# EAGLE design IntelliRoastSch (EAGLE 9.3.1)

## Sheet 1 of 4: STM32 Zio Headers
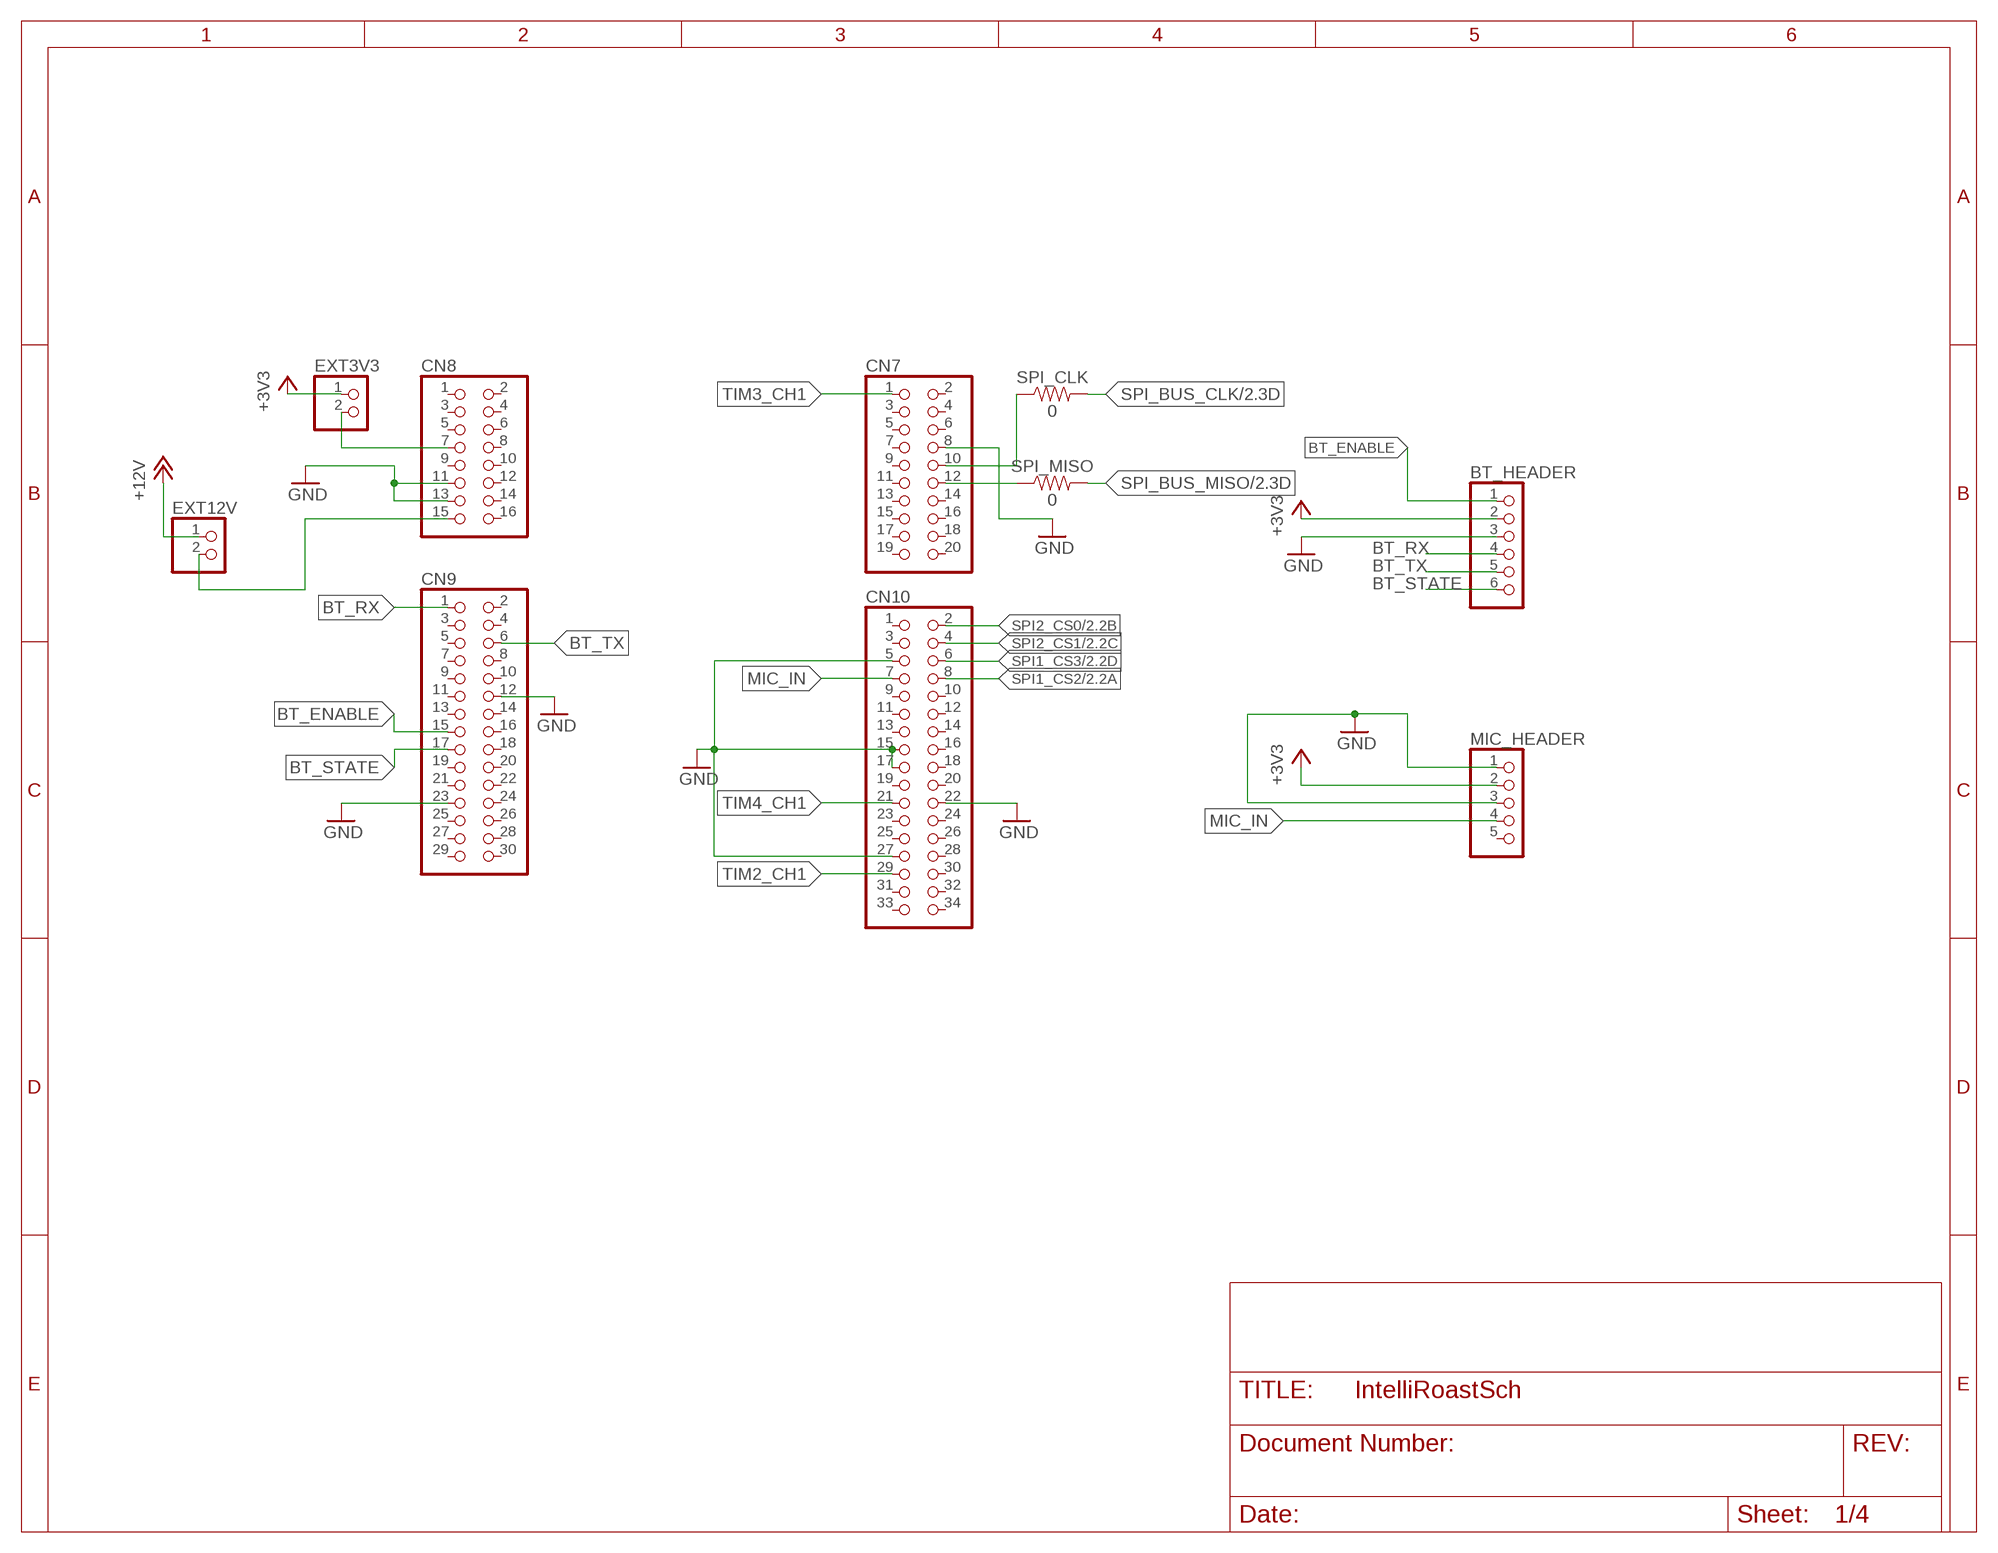
[diagram p0: schematic, sheet 1]

### Parts
BT_HEADER  HC-05-BREAKOUT  [HC-O5_HEADER]
CN7  PINHD-2X10  [2X10]
CN8  PINHD-2X8  [2X08]
CN9  PINHD-2X15  [2X15]
CN10  PINHD-2X17  [2X17]
EXT3V3  PINHD-1X2  [1X02]
EXT12V  PINHD-1X2  [1X02]
MIC_HEADER  PINHD-1X5  [1X05]
SPI_CLK  0  0OHM-0603-1/10W-5%  [0603]
SPI_MISO  0  0OHM-0603-1/10W-5%  [0603]

### Nets
+3V3: BT_HEADER.2 EXT3V3.1 MIC_HEADER.2 ; also sheet 2,3
+12V: EXT12V.1 ; also sheet 3,4
BT_ENABLE: BT_HEADER.1 CN9.15
BT_RX: BT_HEADER.4 CN9.1
BT_STATE: BT_HEADER.6 CN9.17
BT_TX: BT_HEADER.5 CN9.6
GND: BT_HEADER.3 CN7.8 CN8.11 CN8.13 CN9.12 CN9.23 CN10.5 CN10.15 CN10.17 CN10.22 CN10.27 MIC_HEADER.1 MIC_HEADER.3 ; also sheet 2,3,4
MIC_IN: CN10.7 MIC_HEADER.4
N$2: CN8.7 EXT3V3.2
N$3: CN8.15 EXT12V.2
SPI1_CS2: CN10.8 ; also sheet 2
SPI1_CS3: CN10.6 ; also sheet 2
SPI1_MISO: CN7.12 SPI_MISO.1
SPI1_SCK: CN7.10 SPI_CLK.1
SPI2_CS0: CN10.2 ; also sheet 2
SPI2_CS1: CN10.4 ; also sheet 2
SPI_BUS_CLK: SPI_CLK.2 ; also sheet 2
SPI_BUS_MISO: SPI_MISO.2 ; also sheet 2
TIM2_CH1: CN10.29
TIM3_CH1: CN7.1 ; also sheet 4
TIM4_CH1: CN10.21
Unconnected: CN7.2 CN7.3 CN7.4 CN7.5 CN7.6 CN7.7 CN7.9 CN7.11 CN7.13 CN7.14 CN7.15 CN7.16 CN7.17 CN7.18 CN7.19 CN7.20 CN8.1 CN8.2 CN8.3 CN8.4 CN8.5 CN8.6 CN8.8 CN8.9 CN8.10 CN8.12 CN8.14 CN8.16 CN9.2 CN9.3 CN9.4 CN9.5 CN9.7 CN9.8 CN9.9 CN9.10 CN9.11 CN9.13 CN9.14 CN9.16 CN9.18 CN9.19 CN9.20 CN9.21 CN9.22 CN9.24 CN9.25 CN9.26 CN9.27 CN9.28 CN9.29 CN9.30 CN10.1 CN10.3 CN10.9 CN10.10 CN10.11 CN10.12 CN10.13 CN10.14 CN10.16 CN10.18 CN10.19 CN10.20 CN10.23 CN10.24 CN10.25 CN10.26 CN10.28 CN10.30 CN10.31 CN10.32 CN10.33 CN10.34 MIC_HEADER.5

## Sheet 2 of 4: MAX31855 Thermocouple Amplifiers
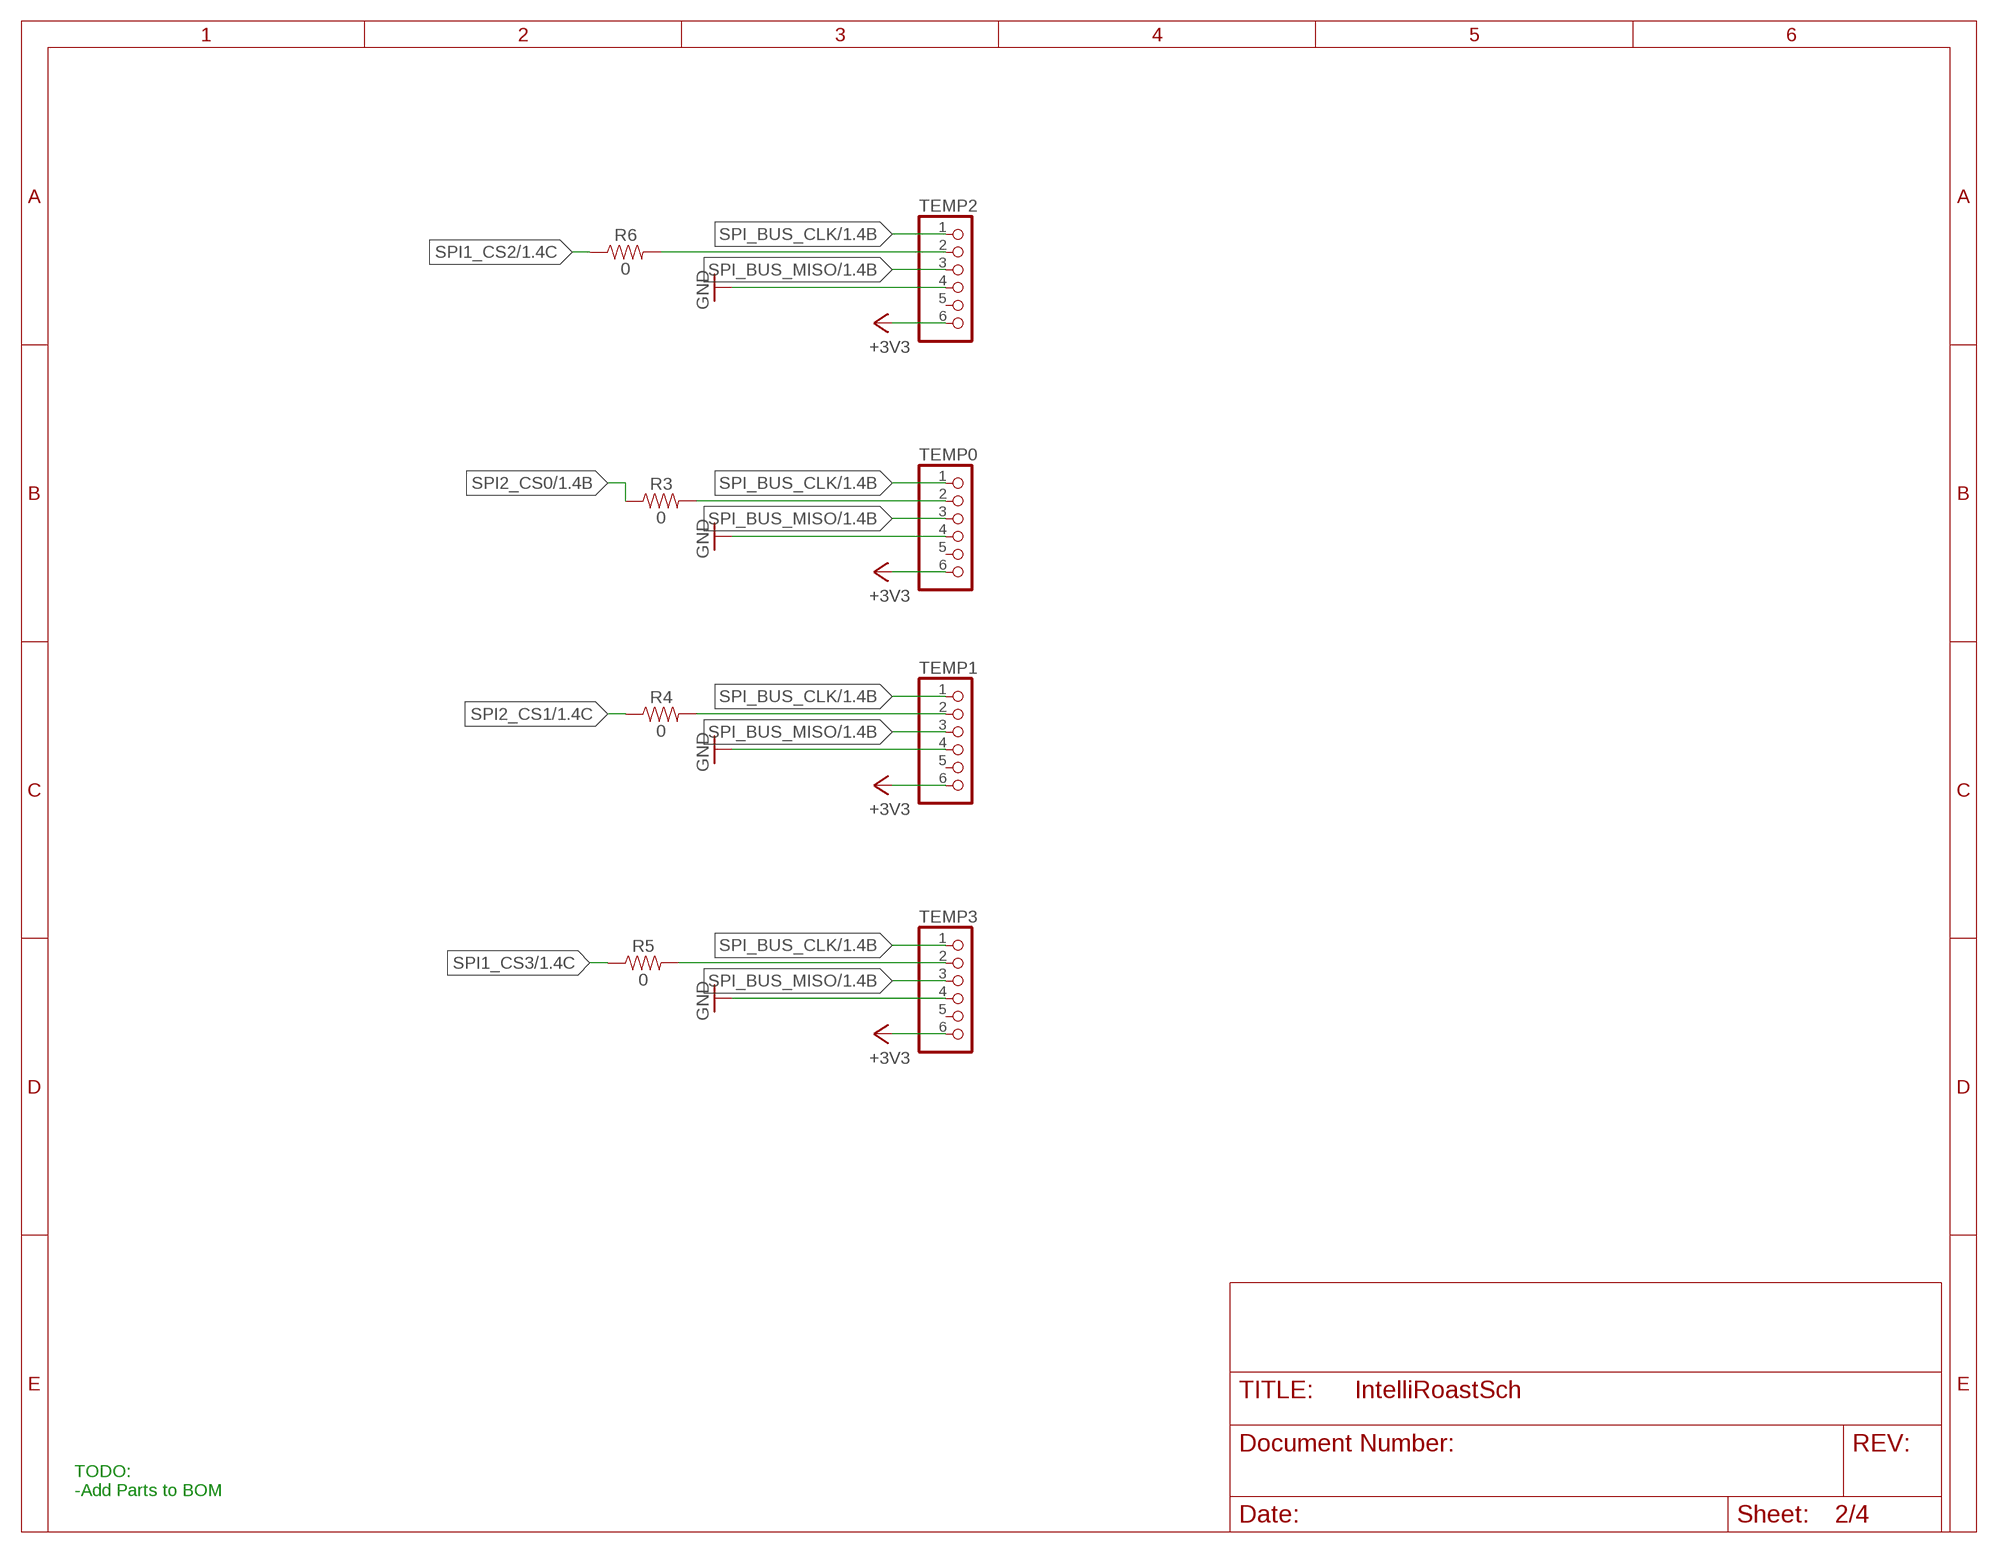
[diagram p1: schematic, sheet 2]

### Parts
R3  0  0OHM-0603-1/10W-5%  [0603]
R4  0  0OHM-0603-1/10W-5%  [0603]
R5  0  0OHM-0603-1/10W-5%  [0603]
R6  0  0OHM-0603-1/10W-5%  [0603]
TEMP0  ADAFRUIT-MAX31855-BREAKOUT  [MAX31855_HEADER]
TEMP1  ADAFRUIT-MAX31855-BREAKOUT  [MAX31855_HEADER]
TEMP2  ADAFRUIT-MAX31855-BREAKOUT  [MAX31855_HEADER]
TEMP3  ADAFRUIT-MAX31855-BREAKOUT  [MAX31855_HEADER]

### Nets
+3V3: TEMP0.6 TEMP1.6 TEMP2.6 TEMP3.6 ; also sheet 1,3
GND: TEMP0.4 TEMP1.4 TEMP2.4 TEMP3.4 ; also sheet 1,3,4
SPI1_CS2: R6.1 ; also sheet 1
SPI1_CS2_RES: R6.2 TEMP2.2
SPI1_CS3: R5.1 ; also sheet 1
SPI1_CS3_RES: R5.2 TEMP3.2
SPI2_CS0: R3.1 ; also sheet 1
SPI2_CS0_RES: R3.2 TEMP0.2
SPI2_CS1: R4.1 ; also sheet 1
SPI2_CS1_RES: R4.2 TEMP1.2
SPI_BUS_CLK: TEMP0.1 TEMP1.1 TEMP2.1 TEMP3.1 ; also sheet 1
SPI_BUS_MISO: TEMP0.3 TEMP1.3 TEMP2.3 TEMP3.3 ; also sheet 1
Unconnected: TEMP0.5 TEMP1.5 TEMP2.5 TEMP3.5

### Notes on the sheet
- TODO:
  -Add Parts to BOM

## Sheet 3 of 4: 3V3 Power Regulator
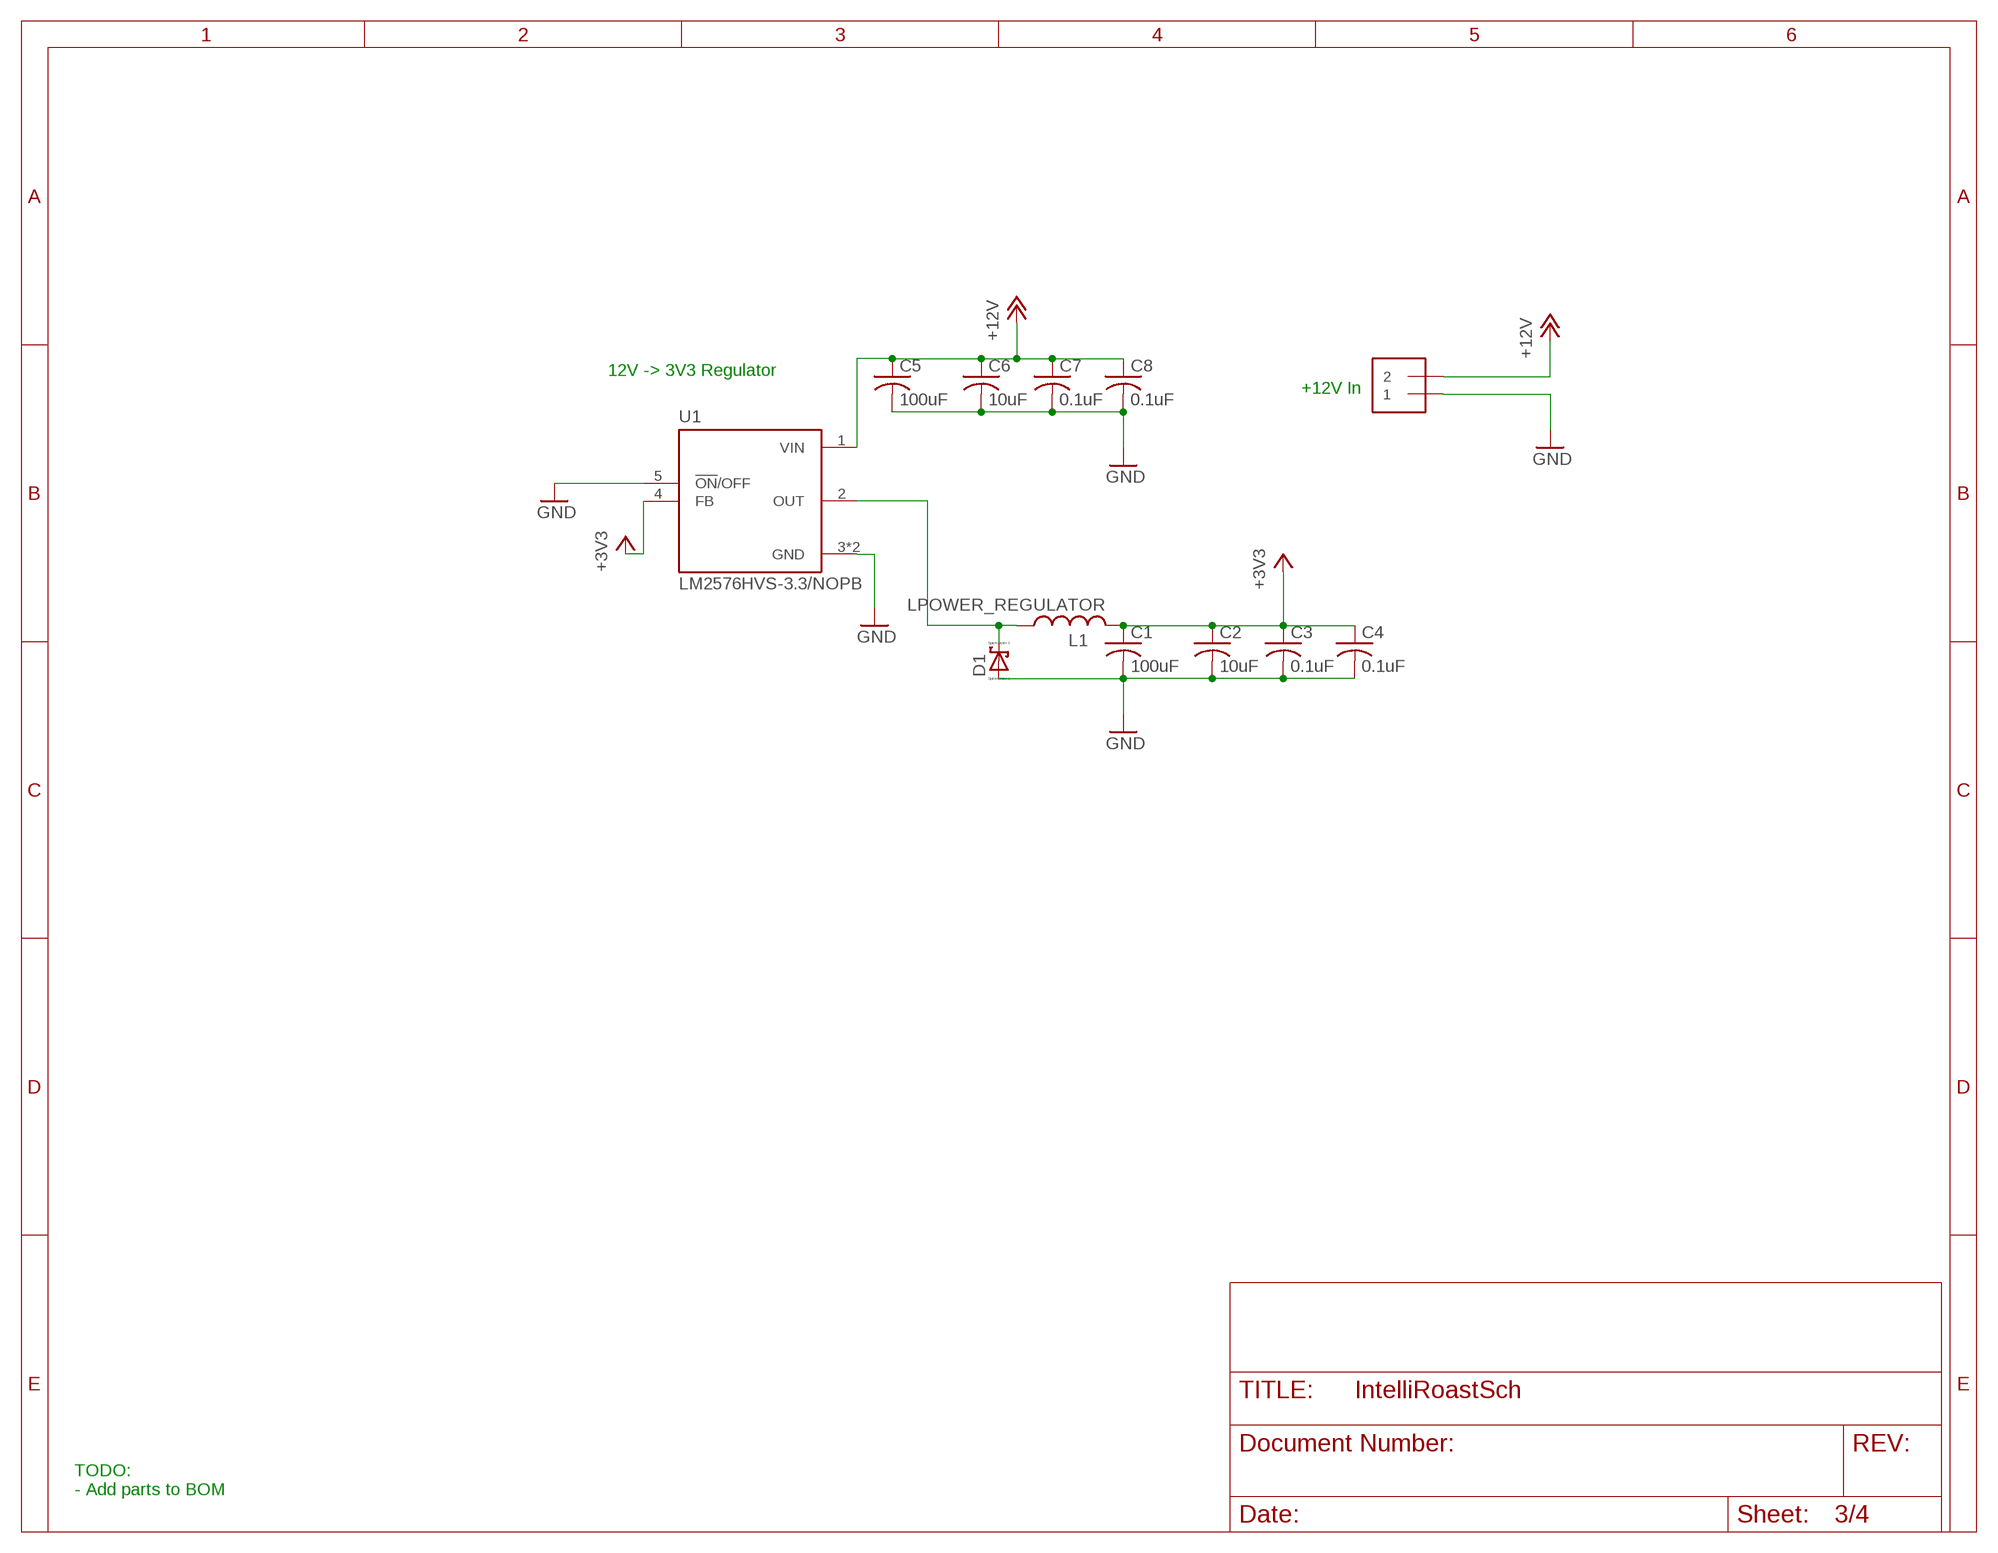
[diagram p2: schematic, sheet 3]

### Parts
C1  100uF  C-USC1210  [C1210]
C2  10uF  C-USC0805  [C0805]
C3  0.1uF  C-USC0603  [C0603]
C4  0.1uF  C-USC0603  [C0603]
C5  100uF  C-USC1210  [C1210]
C6  10uF  C-USC0805  [C0805]
C7  0.1uF  C-USC0603  [C0603]
C8  0.1uF  C-USC0603  [C0603]
D1  SCHOTTKY-DIODESMC  [DIODE_SMC]
L1  LPOWER_REGULATOR  [L74477020]
PWR_IN  1X2-3.5MM  [1X2-3.5MM]
U1  LM2576HVS-3.3/NOPB  [TO170P1435X465-6N]

### Nets
+3V3: C1.1 C2.1 C3.1 C4.1 L1.2 U1.4(FB) ; also sheet 1,2
+12V: C5.1 C6.1 C7.1 C8.1 PWR_IN.2 U1.1(VIN) ; also sheet 1,4
GND: C1.2 C2.2 C3.2 C4.2 C5.2 C6.2 C7.2 C8.2 D1.A(C) PWR_IN.1 U1.3(GND) U1.5(!ON!/OFF) U1.6(GND) ; also sheet 1,2,4
OUT: D1.C(A) L1.1 U1.2(OUT)

### Notes on the sheet
- 12V -> 3V3 Regulator
- +12V In
- TODO:
  - Add parts to BOM

## Sheet 4 of 4: Fan Controller
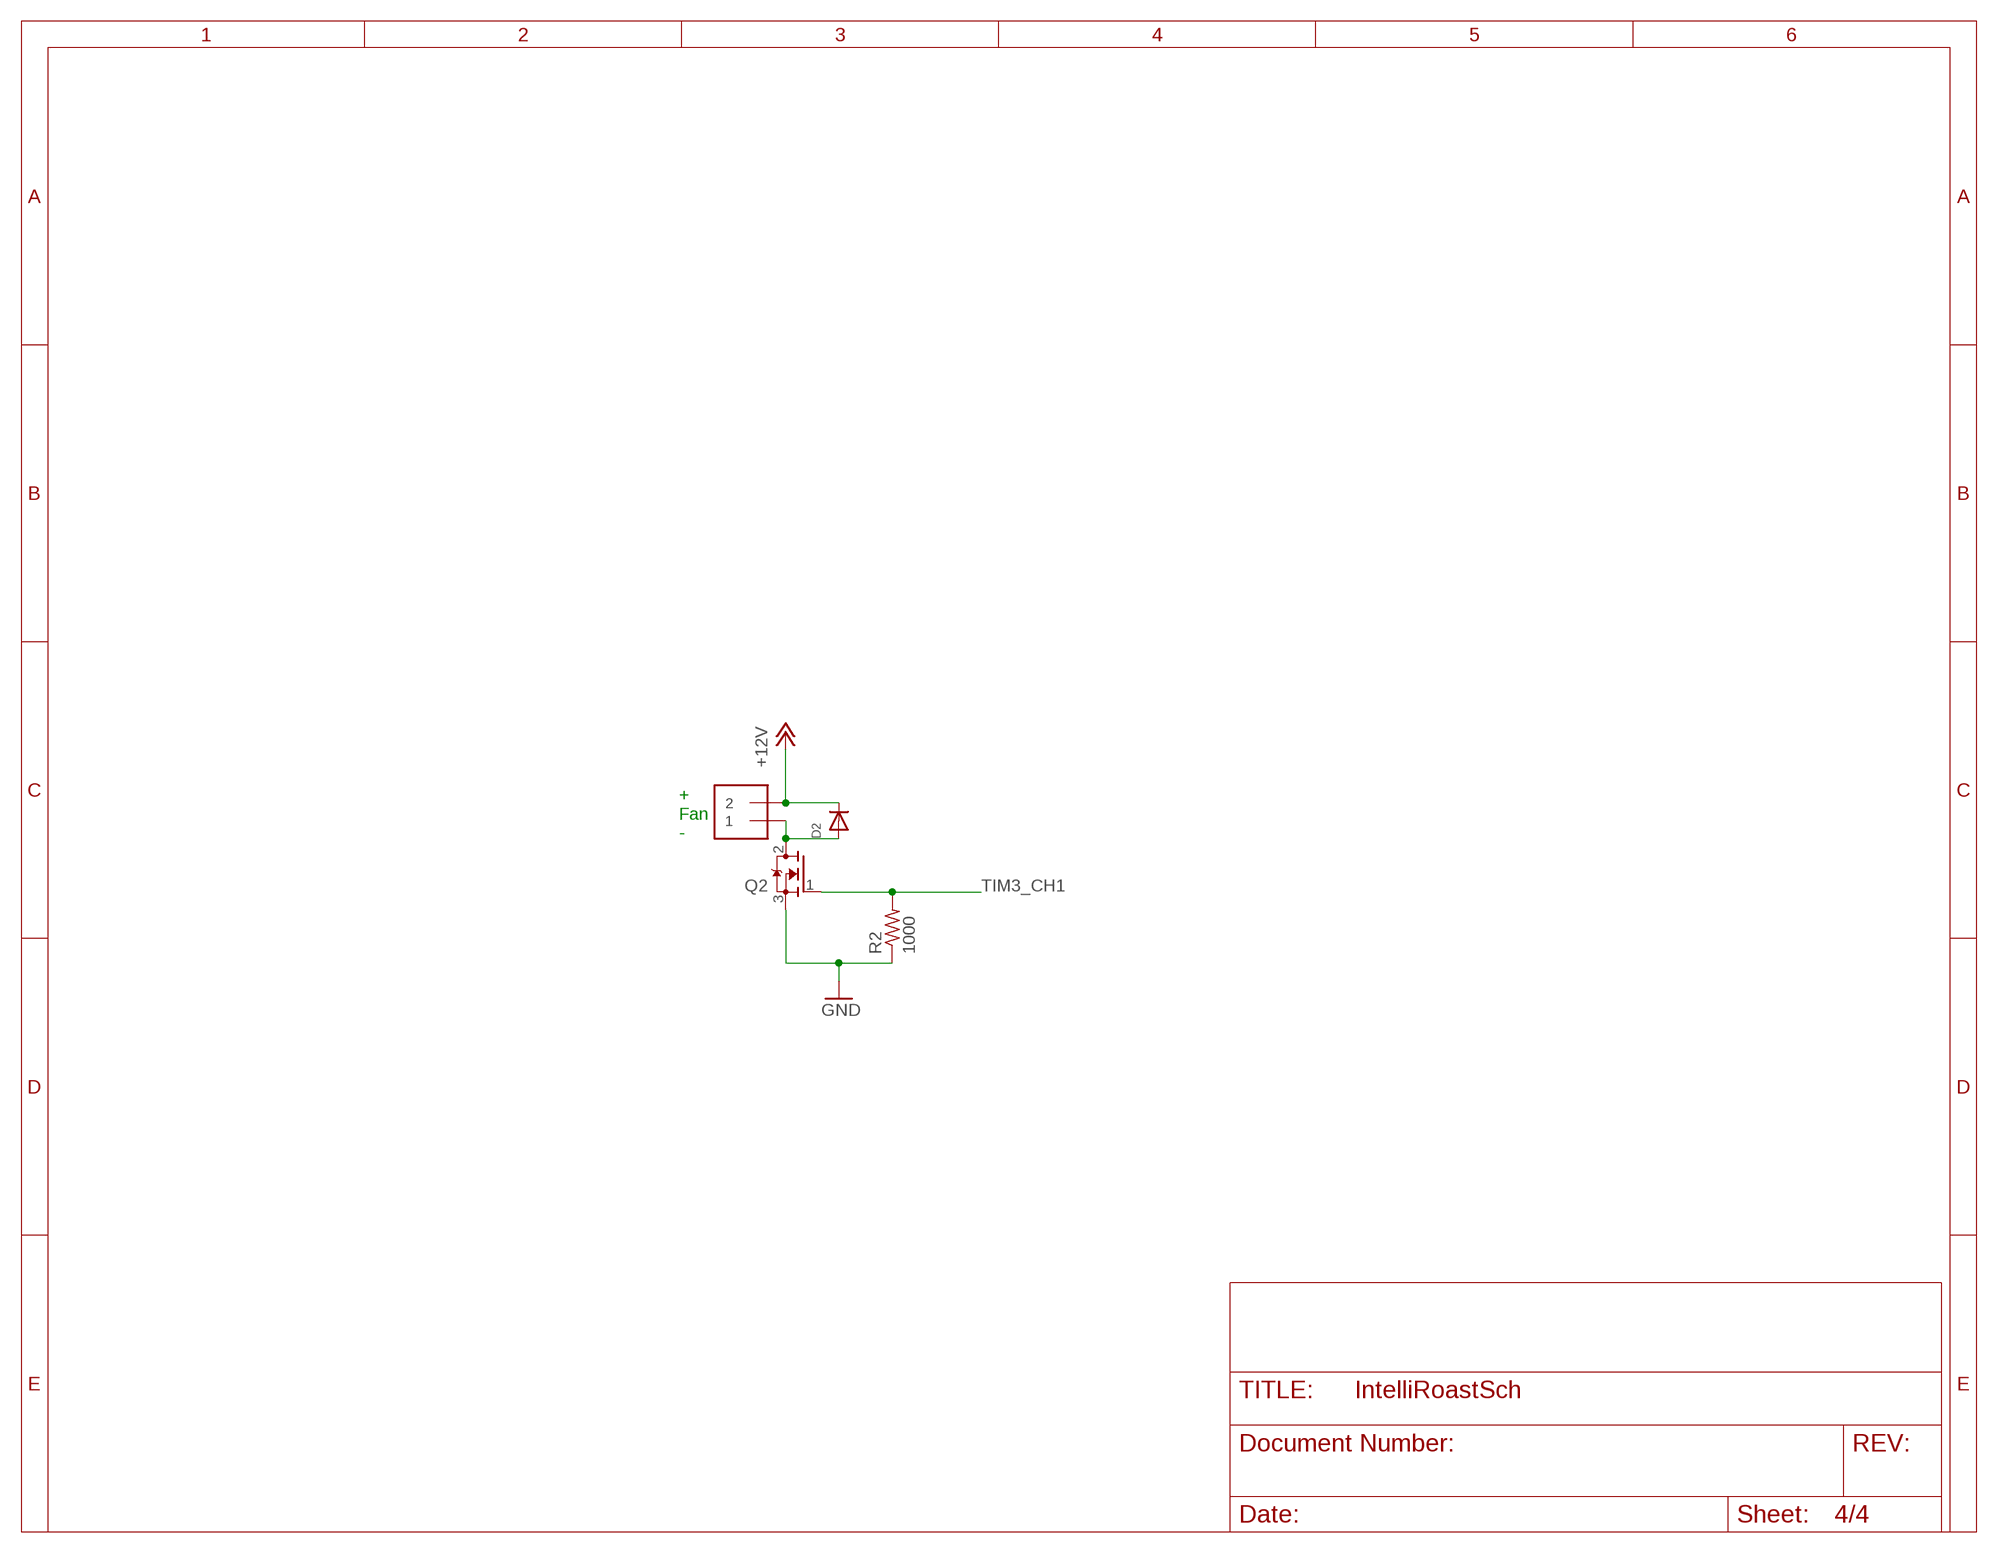
[diagram p3: schematic, sheet 4]

### Parts
D2  DIODESMA  [SMADIODE]
FAN  1X2-3.5MM  [1X2-3.5MM]
Q2  MOSFET-NGDS_TO220V  [TO220V]
R2  1000  R-US_R0603  [R0603]

### Nets
+12V: D2.C FAN.2 ; also sheet 1,3
FAN_TO_MOS: D2.A FAN.1 Q2.2(D)
GND: Q2.3(S) R2.1 ; also sheet 1,2,3
TIM3_CH1: Q2.1(G) R2.2 ; also sheet 1

### Notes on the sheet
- +
  Fan
  -

## Library data of the parts
BT_HEADER = IntelliRoast:HC-05-BREAKOUT: PIN HEADER
C1-C8 = adafruit:C-US: CAPACITOR, American symbol
CN7 = pinhead:PINHD-2X10: PIN HEADER
CN8 = pinhead:PINHD-2X8: PIN HEADER
CN9 = pinhead:PINHD-2X15: PIN HEADER
CN10 = pinhead:PINHD-2X17: PIN HEADER
D1 = eagle-ltspice:SCHOTTKY-DIODE: Schottky Diode; SPICEMODEL: NONE; SPICEPREFIX: D; SPICETYPE: diode
D2 = adafruit:DIODE: Diode SMADIODE - SMA Surface Mount Package 20V 1A Schottky Diode Digikey: 641-1014-6-ND DO-1N4148 - Through Hole Small Current Diode SOD-123 20V 1 A (.5mV Vf) Schottky Diode - Digikey: MBRX120TPMSCT-ND SOD-323 10V 570mA (.38mV Vf, 3ns) Schottky Diode - Digikey: ZLLS410CT-ND SOD-523 30V 30mA Schottky Diode (RB751S-40TE61) - Digikey: RB751S-40TE61CT-ND SOT23-R/W - SOT23 Package (R = Solder Paste/Reflow Ovens, W = Hand-Soldering) BAT54Film 40V 300mA - Digikey: 497-7162-1-ND
EXT3V3 EXT12V = pinhead:PINHD-1X2: PIN HEADER
FAN PWR_IN = adafruit:1X2: 3.5mm Terminal block http://www.ladyada.net/library/pcb/eaglelibrary.html
L1 = IntelliRoast:L
MIC_HEADER = pinhead:PINHD-1X5: PIN HEADER
Q2 = adafruit:MOSFET-N: N-Channel Mosfet 2N7002E - 60V 260mA SOT23 [Digikey: 2N7002ET1GOSTR-ND] - REEL BSH103 - 30V 850mA SOT23 [Digikey: 568-5013-1-ND]
R2 = rcl:R-US_: RESISTOR, American symbol; SPICEPREFIX: R
R3-R6 SPI_CLK SPI_MISO = SparkFun-Resistors:0OHM: 0Ω resistor A resistor is a passive two-terminal electrical component that implements electrical resistance as a circuit element. Resistors act to reduce current flow, and, at the same time, act to lower voltage levels within circuits. - Wikipedia; PROD_ID: RES-08609
TEMP0 TEMP1-TEMP3 = IntelliRoast:ADAFRUIT-MAX31855-BREAKOUT: PIN HEADER
U1 = LM2576HVS-3.3_NOPB:LM2576HVS-3.3/NOPB: SIMPLE SWITCHER? 4V to 60V, 3A Low Component Count Step-Down Regulator 5-DDPAK/TO-263 -40 to 125; AVAILABILITY: Unavailable; DESCRIPTION: SIMPLE SWITCHER? 4V to 60V, 3A Low Component Count Step-Down Regulator 5-DDPAK/TO-263 -40 to 125; MF: Texas Instruments; MP: LM2576HVS-3.3/NOPB; PACKAGE: TO-263-5 Texas Instruments; PRICE: None

## Board
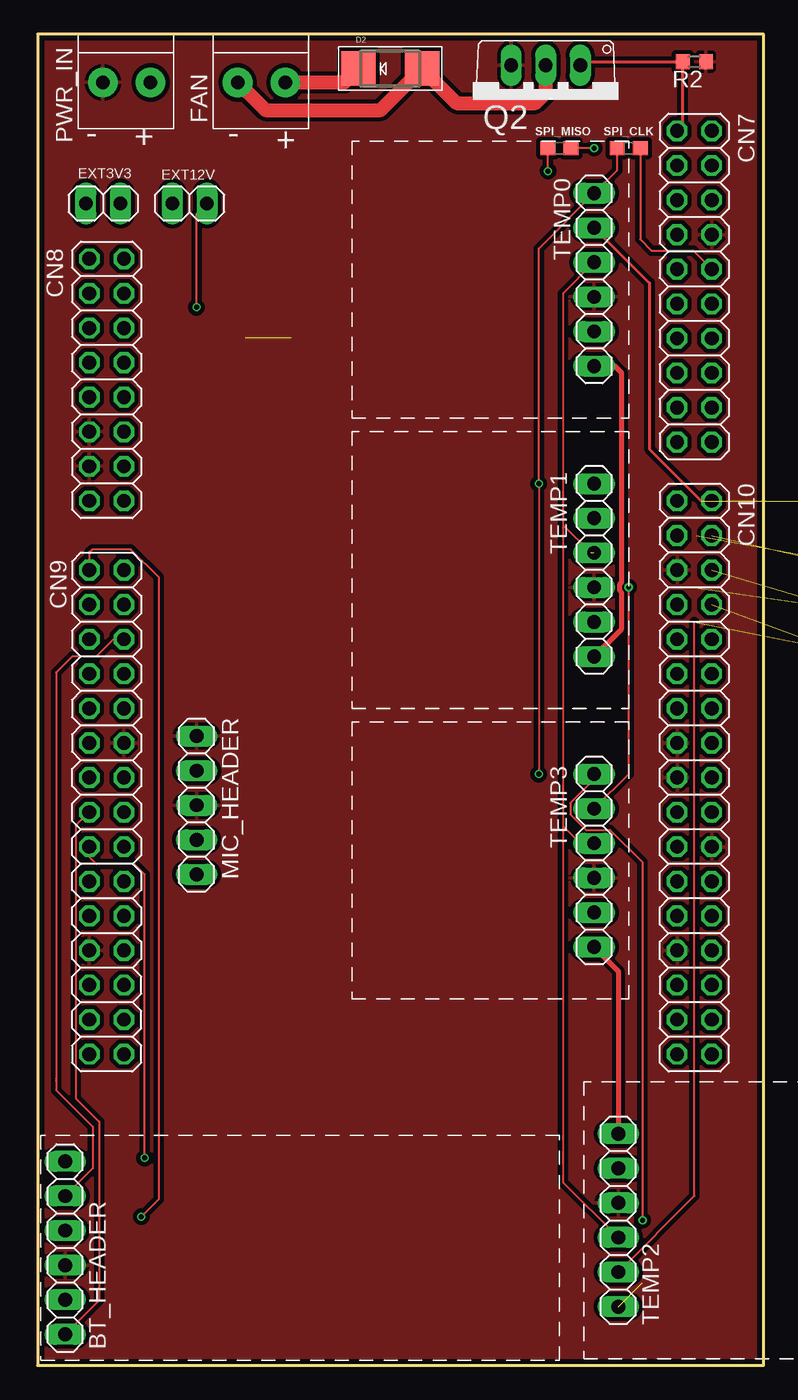
[diagram p4: board, top side]
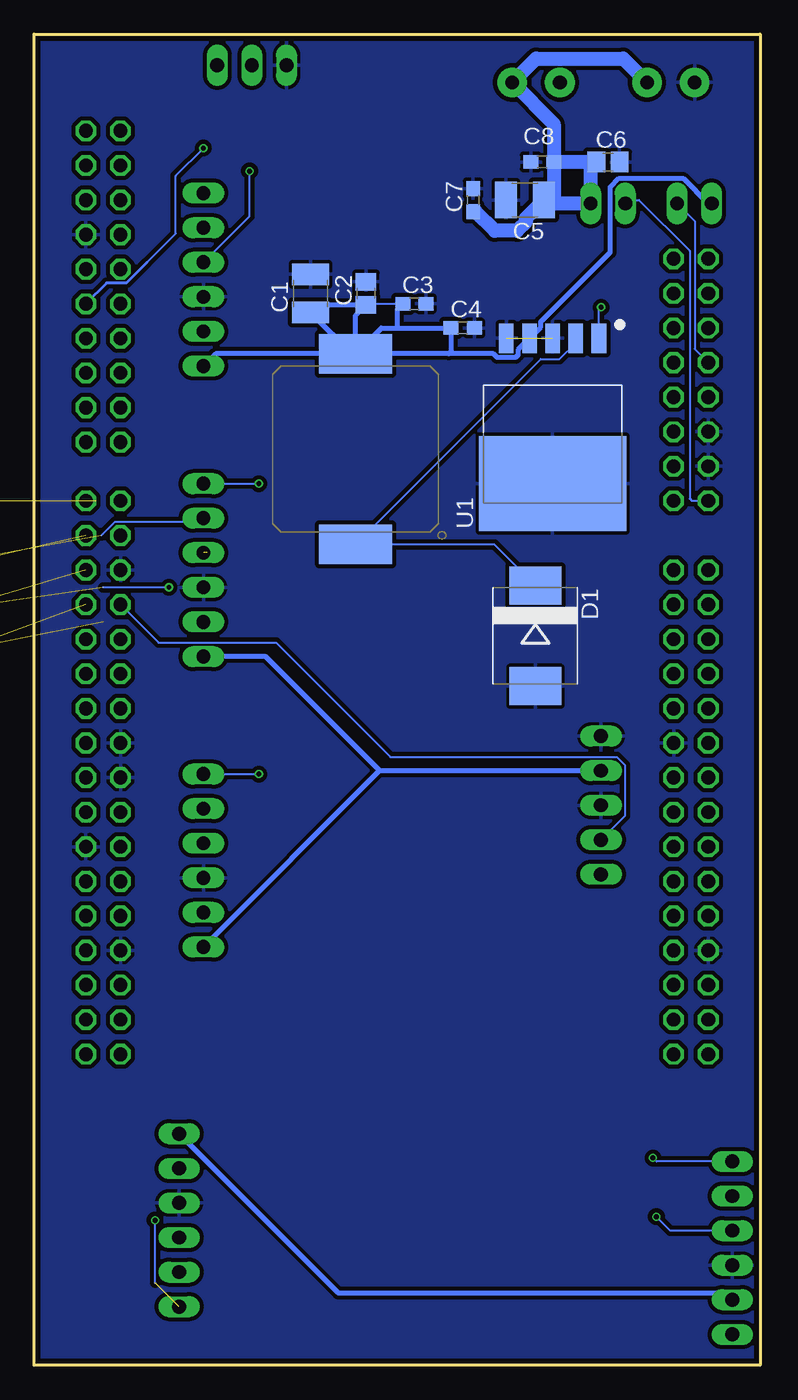
[diagram p5: board, bottom side, seen from below]

Size 53.34 x 97.79 mm. Coordinates in mm from the lower left corner, seen from the top.
Outline: 0,0 53.34,0 53.34,97.79 0,97.79 0,0
Copper layers (1*16): Top 0.035559375mm / dielectric 1.6mm / Bottom 0.035559375mm
Design rules "oshpark-2layer-tented": minimum track width 6mil, minimum drill 10mil, track to track 6mil, track to pad 6mil, pad to pad 6mil, via to via 6mil, smd to smd 6mil, copper to edge 15mil, drill to drill 6mil, minimum pad ring 5mil, minimum via ring 5mil, stop-mask expansion 2.5mil, vias tented up to drill 20mil, thermal gap 10mil

### Footprints (pad centres in the part's own frame; a part is rotated, then mirrored left to right if it is on the bottom)
HC-O5_HEADER = drill 1.016 long: 1 -6.35,0; 2 -3.81,0; 3 -1.27,0; 4 1.27,0; 5 3.81,0; 6 6.35,0
C1210 = smd 1.6 x 2.7: 1 -1.4,0; 2 1.4,0
C0805 = smd 1.3 x 1.5: 1 -0.85,0; 2 0.85,0
C0603 = smd 1.1 x 1: 1 -0.85,0; 2 0.85,0
2X10 = drill 1.016 octagon: 1 -11.43,-1.27; 2 -11.43,1.27; 3 -8.89,-1.27; 4 -8.89,1.27; 5 -6.35,-1.27; 6 -6.35,1.27; 7 -3.81,-1.27; 8 -3.81,1.27; 9 -1.27,-1.27; 10 -1.27,1.27; 11 1.27,-1.27; 12 1.27,1.27; 13 3.81,-1.27; 14 3.81,1.27; 15 6.35,-1.27; 16 6.35,1.27; 17 8.89,-1.27; 18 8.89,1.27; 19 11.43,-1.27; 20 11.43,1.27
2X08 = drill 1.016 octagon: 1 -8.89,-1.27; 2 -8.89,1.27; 3 -6.35,-1.27; 4 -6.35,1.27; 5 -3.81,-1.27; 6 -3.81,1.27; 7 -1.27,-1.27; 8 -1.27,1.27; 9 1.27,-1.27; 10 1.27,1.27; 11 3.81,-1.27; 12 3.81,1.27; 13 6.35,-1.27; 14 6.35,1.27; 15 8.89,-1.27; 16 8.89,1.27
2X15 = drill 1.016 octagon: 1 -17.78,-1.27; 2 -17.78,1.27; 3 -15.24,-1.27; 4 -15.24,1.27; 5 -12.7,-1.27; 6 -12.7,1.27; 7 -10.16,-1.27; 8 -10.16,1.27; 9 -7.62,-1.27; 10 -7.62,1.27; 11 -5.08,-1.27; 12 -5.08,1.27; 13 -2.54,-1.27; 14 -2.54,1.27; 15 0,-1.27; 16 0,1.27; 17 2.54,-1.27; 18 2.54,1.27; 19 5.08,-1.27; 20 5.08,1.27; 21 7.62,-1.27; 22 7.62,1.27; 23 10.16,-1.27; 24 10.16,1.27; 25 12.7,-1.27; 26 12.7,1.27; 27 15.24,-1.27; 28 15.24,1.27; 29 17.78,-1.27; 30 17.78,1.27
2X17 = drill 1.016 octagon: 1 -20.32,-1.27; 2 -20.32,1.27; 3 -17.78,-1.27; 4 -17.78,1.27; 5 -15.24,-1.27; 6 -15.24,1.27; 7 -12.7,-1.27; 8 -12.7,1.27; 9 -10.16,-1.27; 10 -10.16,1.27; 11 -7.62,-1.27; 12 -7.62,1.27; 13 -5.08,-1.27; 14 -5.08,1.27; 15 -2.54,-1.27; 16 -2.54,1.27; 17 0,-1.27; 18 0,1.27; 19 2.54,-1.27; 20 2.54,1.27; 21 5.08,-1.27; 22 5.08,1.27; 23 7.62,-1.27; 24 7.62,1.27; 25 10.16,-1.27; 26 10.16,1.27; 27 12.7,-1.27; 28 12.7,1.27; 29 15.24,-1.27; 30 15.24,1.27; 31 17.78,-1.27; 32 17.78,1.27; 33 20.32,-1.27; 34 20.32,1.27
DIODE_SMC = smd 2.8 x 3.8: A 3.7,0; C -3.7,0
SMADIODE = smd 2.54 x 2.54: A 2.349,0; C -2.349,0
1X02 = drill 1.016 long: 1 -1.27,0; 2 1.27,0
1X2-3.5MM = drill 1 pad 2.184: 1 1.8,0; 2 -1.7,0
L74477020 = smd 5.385 x 2.896: 1 0,7; 2 0,-7
1X05 = drill 1.016 long: 1 -5.08,0; 2 -2.54,0; 3 0,0; 4 2.54,0; 5 5.08,0
TO220V = drill 1.016 long: 1 -2.54,-2.54; 2 0,-2.54; 3 2.54,-2.54
R0603 = smd 1 x 1.1: 1 -0.85,0; 2 0.85,0
0603 = smd 1.1 x 1: 1 -0.85,0; 2 0.85,0
MAX31855_HEADER = drill 1.016 long: 1 -6.35,0; 2 -3.81,0; 3 -1.27,0; 4 1.27,0; 5 3.81,0; 6 6.35,0
TO170P1435X465-6N = smd 2.16 x 1.07: 1 -5.338,3.4; 2 -5.338,1.7; 3 -5.338,0; 4 -5.338,-1.7; 5 -5.338,-3.4 | smd 6.99 x 10.8: 6 5.338,0

### Placement (x,y rotation side)
BT_HEADER  2.03,8.64 90 top
C1  33.02,78.74 90 bottom
C2  28.96,78.74 90 bottom
C3  25.4,77.98 0 bottom
C4  21.84,76.2 0 bottom
C5  17.27,85.6 180 bottom
C6  11.18,88.39 0 bottom
C7  21.08,85.6 90 bottom
C8  16,88.39 180 bottom
CN7  48.26,79.25 270 top
CN8  5.08,72.39 270 top
CN9  5.08,40.64 270 top
CN10  48.26,43.18 270 top
D1  16.51,53.59 270 bottom
D2  25.91,95.25 0 top
EXT3V3  4.83,85.34 0 top
EXT12V  11.18,85.34 180 top
FAN  16.51,94.23 180 top
L1  29.72,67.31 180 bottom
MIC_HEADER  11.68,41.15 270 top
PWR_IN  6.6,94.23 180 top
Q2  37.34,92.96 180 top
R2  48.26,95.76 180 top
R3  61.34,63.5 180 top  (outside the outline)
R4  61.47,58.42 0 top  (outside the outline)
R5  61.47,55.12 0 top  (outside the outline)
R6  61.47,51.82 0 top  (outside the outline)
SPI_CLK  43.43,89.41 180 top
SPI_MISO  38.35,89.41 180 top
TEMP0  40.89,79.76 270 top
TEMP1  40.89,58.42 270 top
TEMP2  42.67,10.67 90 top
TEMP3  40.89,37.08 270 top
U1  15.24,70.1 270 bottom

### Tracks (layer width: path | path; a pad name or v marks a point on that pad's centre or on a via)
+3V3
  Top 0.356: TEMP3.6 42.67,28.96 TEMP2.6 | TEMP1.6 42.93,54.1 42.93,56.76 42.8,56.89 42.8,57.41 42.93,57.54 42.93,72.9 42.42,73.41 TEMP0.6
  Bottom 0.152: C3.1 28.87,77.98 C2.1 29.04,77.81 | C1.1 32.47,77.89 32,77.89
  Bottom 0.356: BT_HEADER.2 2.54,5.33 30.99,5.33 TEMP2.6 | TEMP3.6 27.94,43.69 | 27.94,43.69 MIC_HEADER.2 | 27.94,43.69 36.32,52.07 TEMP1.6 | EXT3V3.1 3.79,85.34 5.64,87.2 10.36,87.2 11,86.56 11,81.77 16.11,76.66 16.11,76.28 U1.4 17.77,74.61 17.77,74.22 17.97,74.03 19.31,74.03 19.59,74.31 22.86,74.31 | 22.86,74.31 L1.2 | 22.86,74.31 22.69,74.48 C4.1 26.67,76.2 | L1.2 29.72,77.13 29.04,77.81 | L1.2 27.83,76.2 26.67,76.2 | C3.1 26.67,77.56 26.67,76.2 | C2.1 32,77.89 | C1.1 29.99,74.31 L1.2 | L1.2 39.99,74.31 TEMP0.6
+12V  (via drill 0.35)
  Top 0.152: v11.68,77.72 11.68,84.58 EXT12V.1
  Top 1.016: FAN.2 22.54,94.23 D2.C
  Bottom 0.152: U1.1 11.84,77.57 v11.68,77.72
  Bottom 1.016: PWR_IN.2 10.06,95.99 16.46,95.99 FAN.2 15.15,91.18 C8.1 | C8.1 C6.1 12.45,87.97 EXT12V.1 15.62,85.34 | 15.62,85.34 C5.1 17.21,84.26 17.21,83.97 17.85,83.33 19.49,83.33 20.91,84.75 C7.1 | C8.1 15.15,85.81 15.62,85.34
BT_ENABLE
  Top 0.152: CN9.15 2.82,39.65 2.82,19.63 4.55,17.9 4.55,4.8 BT_HEADER.1
BT_RX  (via drill 0.35)
  Top 0.152: v7.62,10.92 8.89,12.19 8.89,57.91 6.86,59.94 4.06,59.94 3.81,59.69 CN9.1
  Bottom 0.152: BT_HEADER.4 6.6,9.91 v7.62,10.92
BT_STATE  (via drill 0.35)
  Top 0.152: v7.87,15.24 7.87,36.07 7.11,36.83 4.32,36.83 3.81,37.34 CN9.17
  Bottom 0.152: BT_HEADER.6 7.62,14.99 v7.87,15.24
BT_TX
  Top 0.152: CN9.6 5.59,53.34 4.32,52.07 2.54,52.07 1.37,50.9 1.37,21.08 1.37,20.93 1.37,20.22 4.06,17.53 4.06,14.48 BT_HEADER.5
FAN_TO_MOS
  Top 1.016: Q2.2 37.34,93.47 36.58,92.71 30.8,92.71 D2.A 25.21,92.2 16.74,92.2 FAN.1
GND  (1 unrouted)
  pour Top (isolate 0.305): -2.54,99.31 -2.54,-3.81 55.63,-3.81 55.63,99.31
  pour Bottom (isolate 0.305): -1.02,102.36 56.9,102.36 56.9,-2.29 -1.02,-2.29
MIC_IN
  Bottom 0.152: CN10.7 44.2,53.09 35.56,53.09 27.15,44.68 10.51,44.68 9.93,44.1 9.93,40.36 MIC_HEADER.4
N$2
  Bottom 0.152: CN8.7 4.81,74.66 4.81,84.06 EXT3V3.2
N$3
  Bottom 0.152: EXT12V.2 9.65,85.6 8.89,85.6 5.17,81.87 5.17,63.67 5,63.5 CN8.15
OUT
  Bottom 0.152: U1.2 13.54,75.11 14.73,73.91 16.11,73.91 L1.1 19.53,60.31 D1.C
SPI1_CS2  (1 unrouted)
SPI1_CS2_RES  (1 unrouted)
  Top 0.152: TEMP2.2 48.26,12.45 48.26,54.61
SPI1_CS3  (1 unrouted)
SPI1_CS3_RES  (via drill 0.35)  (1 unrouted)
  Top 0.152: TEMP3.2 43.43,43.43 v43.43,57.15
  Bottom 0.152: v43.43,57.15 48.26,57.15
SPI1_MISO  (via drill 0.35)
  Top 0.152: v40.89,89.41 SPI_MISO.1
  Bottom 0.152: 45.05,81.03 42.93,83.15 42.93,87.38 v40.89,89.41
  Bottom 0.203: CN7.12 48.01,79.5 46.57,79.5 45.05,81.03
SPI1_SCK
  Top 0.152: CN7.10 48.16,81.88 45.12,81.88 44.28,82.72 SPI_CLK.1
SPI2_CS0  (1 unrouted)
SPI2_CS0_RES  (1 unrouted)
  Top 0.203: TEMP0.2 44.96,79.5 44.96,67.31 48.77,63.5
SPI2_CS1  (1 unrouted)
SPI2_CS1_RES  (1 unrouted)
  Bottom 0.152: 48.39,60.96 47.4,61.95 41.17,61.95 TEMP1.2
SPI_BUS_CLK  (via drill 0.35)  (1 unrouted)
  Top 0.152: v36.83,43.43 v36.83,64.77 36.83,82.04 TEMP0.1 42.58,87.8 SPI_CLK.2 | TEMP3.1 40.89,43.06 39.14,41.3 39.14,40.48 40.28,39.34 42.07,39.34 44.42,36.99 44.42,10.69 v44.45,10.67
  Bottom 0.152: TEMP3.1 v36.83,43.43 | 44.42,6.07 44.45,6.07 v44.45,10.67 | TEMP1.1 v36.83,64.77
SPI_BUS_MISO  (via drill 0.35)  (1 unrouted)
  Top 0.152: 38.61,61.72 38.61,78.74 TEMP0.3 | 38.61,61.72 40.64,59.69 | TEMP3.3 39.88,38.35 38.61,39.62 | 38.61,39.62 38.61,13.46 TEMP2.3 | 38.61,61.72 38.61,39.62 | v37.5,87.72 SPI_MISO.2
  Bottom 0.152: TEMP0.3 37.5,84.42 v37.5,87.72
TIM3_CH1
  Top 0.203: CN7.1 47.41,91.1 R2.2 40.13,95.76 Q2.1

### Text on the board
tPlace: - | + | - | +